# EAGLE design TF0060DCA (EAGLE 9.6.2)
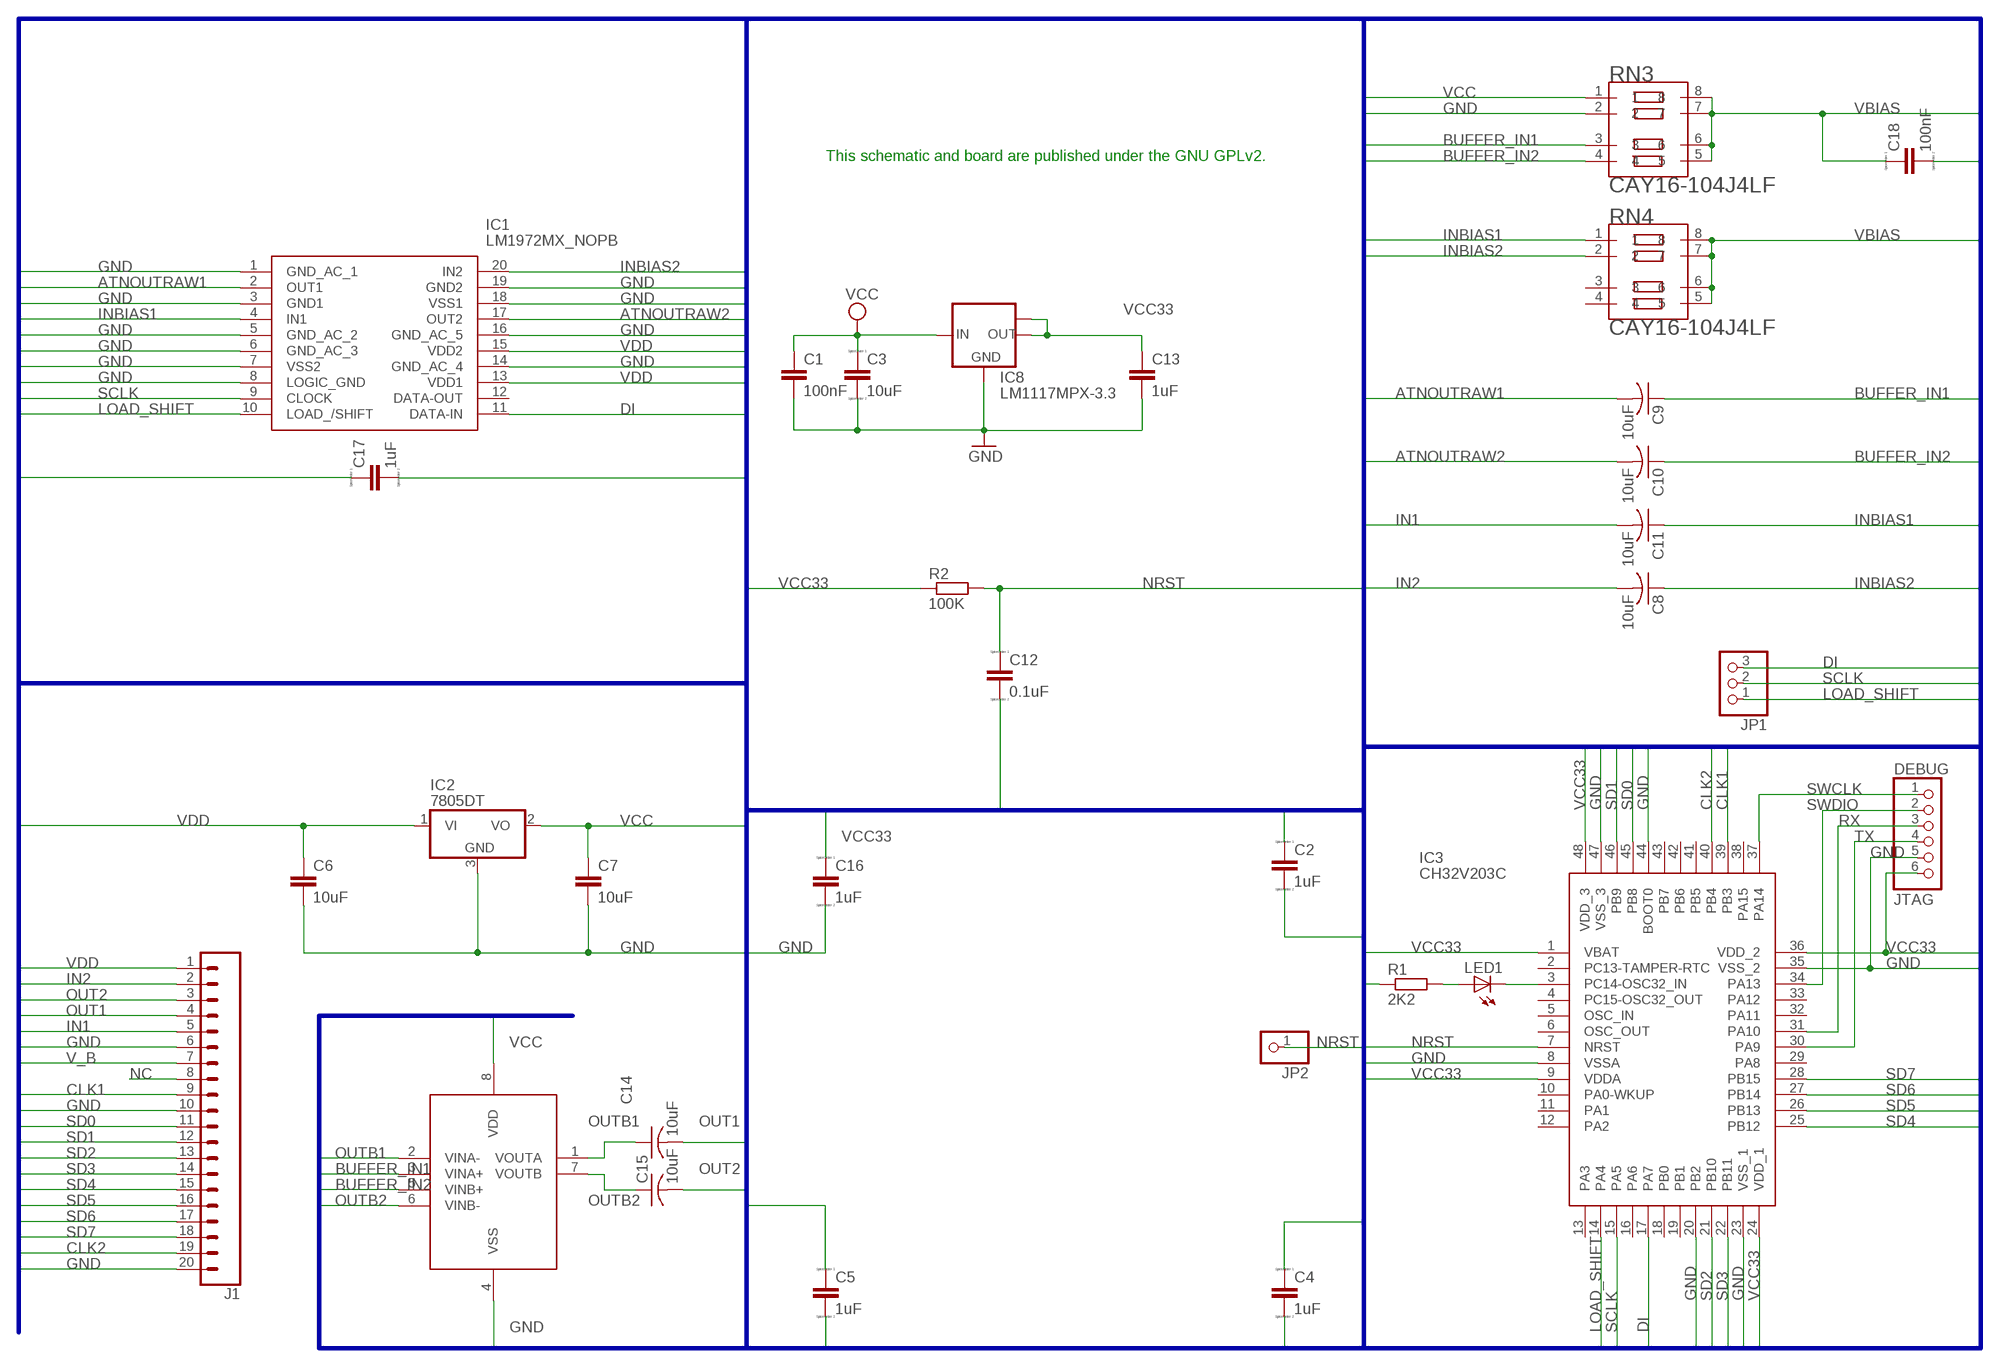
[diagram p0: schematic, sheet 1]

## Parts
C1  100nF  C-EUC1206  [C1206]
C2  1uF  CC0603  [C0603]
C3  10uF  CC0603  [C0603]
C4  1uF  CC0603  [C0603]
C5  1uF  CC0603  [C0603]
C6  10uF  C-EUC1206  [C1206]
C7  10uF  C-EUC1206  [C1206]
C8  10uF  C-USC0805  [C0805]
C9  10uF  C-USC0805  [C0805]
C10  10uF  C-USC0805  [C0805]
C11  10uF  C-USC0805  [C0805]
C12  0.1uF  CC0603  [C0603]
C13  1uF  C-EUC1206  [C1206]
C14  10uF  C-USC0805  [C0805]
C15  10uF  C-USC0805  [C0805]
C16  1uF  CC0603  [C0603]
C17  1uF  CC0603  [C0603]
C18  100nF  CC0603  [C0603]
DEBUG  JTAG  HEADER-1X6ROUND  [1X06_ROUND]
IC1  LM1972MX_NOPB  [SOIC127P1030X265-20N]
IC2  7805DT  [TO252]
IC3  CH32V203C  STM32F103CBT6  [QFP50P900X900X160-48N]
IC8  LM1117MPX-3.3  [SOT223]
IC12  MCP6002T-I_SN  [SOIC127P600X175-8N]
J1  CONN_20  [1X20]
JP1  PINHD-1X3  [1X03]
JP2  PINHD-1X1  [1X01]
LED1  LEDCHIPLED_0603  [CHIPLED_0603]
R1  2K2  R-EU_R0603  [R0603]
R2  100K  R-EU_R0603  [R0603]
RN3  CAY16-104J4LF  CAY16-103J4LF  [RESCAXE80P320X160-8N]
RN4  CAY16-104J4LF  CAY16-103J4LF  [RESCAXE80P320X160-8N]

## Nets
ATNOUTRAW1: C9.2 IC1.2(OUT1)
ATNOUTRAW2: C10.2 IC1.17(OUT2)
BUFFER_IN1: C9.1 IC12.3(VINA+) RN3.3
BUFFER_IN2: C10.1 IC12.5(VINB+) RN3.4
CLK1: IC3.39(PB3) J1.9
CLK2: IC3.40(PB4) J1.19
DI: IC1.11(DATA-IN) IC3.17(PA7) JP1.3
GND: C1.2 C2.2 C3.2 C4.2 C5.2 C6.2 C7.2 C12.2 C13.2 C16.2 C17.2 C18.2 DEBUG.5 IC1.1(GND_AC_1) IC1.3(GND1) IC1.5(GND_AC_2) IC1.6(GND_AC_3) IC1.7(VSS2) IC1.8(LOGIC_GND) IC1.14(GND_AC_4) IC1.16(GND_AC_5) IC1.18(VSS1) IC1.19(GND2) IC2.3(GND) IC3.8(VSSA) IC3.20(PB2) IC3.23(VSS_1) IC3.35(VSS_2) IC3.44(BOOT0) IC3.47(VSS_3) IC8.1(GND) IC12.4(VSS) J1.6 J1.10 J1.20 RN3.2
IN1: C11.2 J1.5
IN2: C8.2 J1.2
INBIAS1: C11.1 IC1.4(IN1) RN4.1
INBIAS2: C8.1 IC1.20(IN2) RN4.2
LOAD_SHIFT: IC1.10(LOAD_/SHIFT) IC3.14(PA4) JP1.1
N$3: IC3.3(PC14-OSC32_IN) LED1.C
N$4: LED1.A R1.2
NC: J1.8
NRST: C12.1 IC3.7(NRST) JP2.1 R2.2
OUT1: C14.2 J1.4
OUT2: C15.2 J1.3
OUTB1: C14.1 IC12.1(VOUTA) IC12.2(VINA-)
OUTB2: C15.1 IC12.6(VINB-) IC12.7(VOUTB)
RX: DEBUG.3 IC3.31(PA10)
SCLK: IC1.9(CLOCK) IC3.15(PA5) JP1.2
SD0: IC3.45(PB8) J1.11
SD1: IC3.46(PB9) J1.12
SD2: IC3.21(PB10) J1.13
SD3: IC3.22(PB11) J1.14
SD4: IC3.25(PB12) J1.15
SD5: IC3.26(PB13) J1.16
SD6: IC3.27(PB14) J1.17
SD7: IC3.28(PB15) J1.18
SWCLK: DEBUG.1 IC3.37(PA14)
SWDIO: DEBUG.2 IC3.34(PA13)
TX: DEBUG.4 IC3.30(PA9)
V_B: J1.7
VBIAS: C18.1 RN3.5 RN3.6 RN3.7 RN3.8 RN4.5 RN4.6 RN4.7 RN4.8
VCC: C1.1 C3.1 C7.1 C17.1 IC2.2(VO) IC8.3(IN) IC12.8(VDD) RN3.1
VCC33: C2.1 C4.1 C5.1 C13.1 C16.1 DEBUG.6 IC3.1(VBAT) IC3.9(VDDA) IC3.24(VDD_1) IC3.36(VDD_2) IC3.48(VDD_3) IC8.2(OUT) IC8.TAB(OUT1) R1.1 R2.1
VDD: C6.1 IC1.13(VDD1) IC1.15(VDD2) IC2.1(VI) J1.1
Unconnected: IC1.12(DATA-OUT) IC3.2(PC13-TAMPER-RTC) IC3.4(PC15-OSC32_OUT) IC3.5(OSC_IN) IC3.6(OSC_OUT) IC3.10(PA0-WKUP) IC3.11(PA1) IC3.12(PA2) IC3.13(PA3) IC3.16(PA6) IC3.18(PB0) IC3.19(PB1) IC3.29(PA8) IC3.32(PA11) IC3.33(PA12) IC3.38(PA15) IC3.41(PB5) IC3.42(PB6) IC3.43(PB7) RN4.3 RN4.4

## Buses
ATNOUTRAW[1..2],BUFFER_IN[1..2],CLK[1..2],CLKOUT,DI,DO,GND,IN[1..2],INBIAS[1..2],LOAD_SHIFT,NRST,OBUF[1..2],OUT[1..2],OUTB[1..2],SCLK,SD[0..7],TCK,TDI,TDO,TMS,V_B,VBIAS,VCC,VCC33,VDD

## Notes on the sheet
- This schematic and board are published under the GNU GPLv2.

## Library data of the parts
C1 C6 C7 C13 = rcl:C-EU: CAPACITOR, European symbol; SPICEPREFIX: C
C2-C5 C12 C16-C18 = eagle-ltspice:C: CAPACITOR, European symbol; SPICEMODEL: NONE; SPICEPREFIX: C
C8-C11 C14 C15 = rcl:C-US: CAPACITOR, American symbol; SPICEPREFIX: C
DEBUG = microbuilder:HEADER-1X6: PIN HEADER
IC1 = SamacSys_Parts:LM1972MX_NOPB: Micro-Pot 2-Channel 78 dB Audio Attenuator with Mute Source: Datasheet <http://www.ti.com/lit/gpn/LM1972>; DESCRIPTION: Micro-Pot 2-Channel 78 dB Audio Attenuator with Mute; HEIGHT: 2.65mm; MANUFACTURER_NAME: Texas Instruments; MANUFACTURER_PART_NUMBER: LM1972MX/NOPB; MOUSER_PART_NUMBER: 926-LM1972MX/NOPB; MOUSER_PRICE-STOCK: https://www.mouser.co.uk/ProductDetail/Texas-Instruments/LM1972MX-NOPB?qs=X1J7HmVL2ZH04ksznhxyxw%3D%3D
IC2 = linear:78*: Positive VOLTAGE REGULATOR Source: http://cache.national.com/ds/LM/LM78L05.pdf http://www.fairchildsemi.com/ds/LM/LM7805.pdf
IC3 = SamacSys_Parts:STM32F103CBT6: STM32F103CBT6, 32 bit ARM Cortex M3 , 72MHz, 128 kB ROM , 20 kB RAM USB CAN I2C, 48 LQFP Source: Datasheet <http://www.st.com/st-web-ui/static/active/en/resource/technical/document/datasheet/CD00161566.pdf>; DESCRIPTION: STM32F103CBT6, 32 bit ARM Cortex M3 , 72MHz, 128 kB ROM , 20 kB RAM USB CAN I2C, 48 LQFP; HEIGHT: 1.6mm; MANUFACTURER_NAME: STMicroelectronics; MANUFACTURER_PART_NUMBER: STM32F103CBT6; MOUSER_PART_NUMBER: 511-STM32F103CBT6; MOUSER_PRICE-STOCK: https://www.mouser.co.uk/ProductDetail/STMicroelectronics/STM32F103CBT6?qs=WxFF5lh7QM3goh6GV5Ogig%3D%3D
IC8 = lm1117:LM1117MPX-*
IC12 = MCP6002T-I_SN:MCP6002T-I_SN: Op. Amplifier Dual 1MHz Low-Power SOIC8 Microchip MCP6002T-I/SN, Dual Low Power Op Amp, 1MHz Rail-Rail, 1.8 6 V, 8-Pin SOIC Source: Datasheet <http://uk.rs-online.com/web/p/products/8234276P>; ALLIED_NUMBER: 70451327; DESCRIPTION: Op. Amplifier Dual 1MHz Low-Power SOIC8 Microchip MCP6002T-I/SN, Dual Low Power Op Amp, 1MHz Rail-Rail, 1.8 6 V, 8-Pin SOIC; HEIGHT: 1.75mm; MANUFACTURER_NAME: Microchip; MANUFACTURER_PART_NUMBER: MCP6002T-I/SN; RS_PART_NUMBER: 8234276P; RS_PRICE-STOCK: http://uk.rs-online.com/web/p/products/8234276P
J1 = SparkFun-Connectors:CONN_20: Multi connection point. Often used as Generic Header-pin footprint for 0.1 inch spaced/style header connections On any of the 0.1 inch spaced packages, you can populate with these: Break Away Headers - Straight <https://www.sparkfun.com/products/116> (PRT-00116) Break Away Male Headers - Right Angle <https://www.sparkfun.com/products/553> (PRT-00553) Female Headers <https://www.sparkfun.com/products/115> (PRT-00115) Break Away Headers - Machine Pin <https://www.sparkfun.com/products/117> (PRT-00117) Break Away Female Headers - Swiss Machine Pin <https://www.sparkfun.com/products/743> (PRT-00743) For SCREWTERMINALS and SPRING TERMINALS visit here: Screw Terimnals on SparkFun.com <https://www.sparkfun.com/search/results?term=Screw+Terminals> (5mm/3.5mm/2.54mm spacing) This device is also useful as a general connection point to wire up your design to another part of your project. Our various solder wires solder well into these plated through hole pads. Hook-Up Wire - Assortment (Stranded, 22 AWG) <https://www.sparkfun.com/products/11375> (PRT-11375) Hook-Up Wire - Assortment (Solid Core, 22 AWG) <https://www.sparkfun.com/products/11367> (PRT-11367) View the entire wire category on our website here <https://www.sparkfun.com/categories/141> Special notes: Molex polarized connector foot print use with SKU : PRT-08231 with associated crimp pins and housings. 1MM SMD Version SKU: PRT-10208 NOTES ON THE VARIANTS LOCK and LOCK_LONGPADS... This footprint was designed to help hold the alignment of a through-hole component (i.e. 6-pin header) while soldering it into place. You may notice that each hole has been shifted either up or down by 0.005 of an inch from it's more standard position (which is a perfectly straight line). This slight alteration caused the pins (the squares in the middle) to touch the edges of the holes. Because they are alternating, it causes a "brace" to hold the component in place. 0.005 has proven to be the perfect amount of "off-center" position when using our standard breakaway headers. Although looks a little odd when you look at the bare footprint, once you have a header in there, the alteration is very hard to notice. Also,if you push a header all the way into place, it is covered up entirely on the bottom side. Note about LOCK SPECIAL package: This is just like the LOCK variant in that the holes are staggared by 5 mil, but except for the last two holes. They are not altered from the "standard" footprint layout. This is used for a special purpose on the layout of our Graphic LCD Backpack. Make sure you want to use this device before selecting it for you project!
JP1 = adafruit:PINHD-1X3: PIN HEADER
JP2 = pinhead:PINHD-1X1: PIN HEADER
LED1 = adafruit:LED: LED OSRAM: - CHIPLED LG R971, LG N971, LY N971, LG Q971, LY Q971, LO R971, LY R971 LH N974, LH R974 LS Q976, LO Q976, LY Q976 LO Q996 - Hyper CHIPLED LW Q18S LB Q993, LB Q99A, LB R99A - SideLED LS A670, LO A670, LY A670, LG A670, LP A670 LB A673, LV A673, LT A673, LW A673 LH A674 LY A675 LS A676, LA A676, LO A676, LY A676, LW A676 LS A679, LY A679, LG A679 - Hyper Micro SIDELED® LS Y876, LA Y876, LO Y876, LY Y876 LT Y87S - SmartLED LW L88C, LW L88S LB L89C, LB L89S, LG L890 LS L89K, LO L89K, LY L89K LS L896, LA L896, LO L896, LY L896 - TOPLED LS T670, LO T670, LY T670, LG T670, LP T670 LSG T670, LSP T670, LSY T670, LOP T670, LYG T670 LG T671, LOG T671, LSG T671 LB T673, LV T673, LT T673, LW T673 LH T674 LS T676, LA T676, LO T676, LY T676, LB T676, LH T676, LSB T676, LW T676 LB T67C, LV T67C, LT T67C, LS T67K, LO T67K, LY T67K, LW E67C LS E67B, LA E67B, LO E67B, LY E67B, LB E67C, LV E67C, LT E67C LW T67C LS T679, LY T679, LG T679 LS T770, LO T770, LY T770, LG T770, LP T770 LB T773, LV T773, LT T773, LW T773 LH T774 LS E675, LA E675, LY E675, LS T675 LS T776, LA T776, LO T776, LY T776, LB T776 LHGB T686 LT T68C, LB T68C - Hyper Mini TOPLED® LB M676 - Mini TOPLED Santana® LG M470 LS M47K, LO M47K, LY M47K Source: http://www.osram.convergy.de/
R1 R2 = resistor:R-EU_: RESISTOR, European symbol
RN3 RN4 = CAY16-103J4LF:CAY16-103J4LF: Res Thick Film Array 10K Ohm 5% 200ppm/C ISOL Molded 8-Pin 1206(4 X 0603) Convex SMD Paper T/R; AVAILABILITY: Good; DESCRIPTION: Res Thick Film Array 10K Ohm 5% ?200ppm/C ISOL Molded 8-Pin 1206(4 X 0603) Convex SMD Paper T/R; MF: Bourns; MP: CAY16-103J4LF; PACKAGE: 1206 Bourns; PRICE: 0.02 USD

## Net classes
0 default: width 0.152 mm, drill 0.3 mm, clearance 0.152 mm

## Board
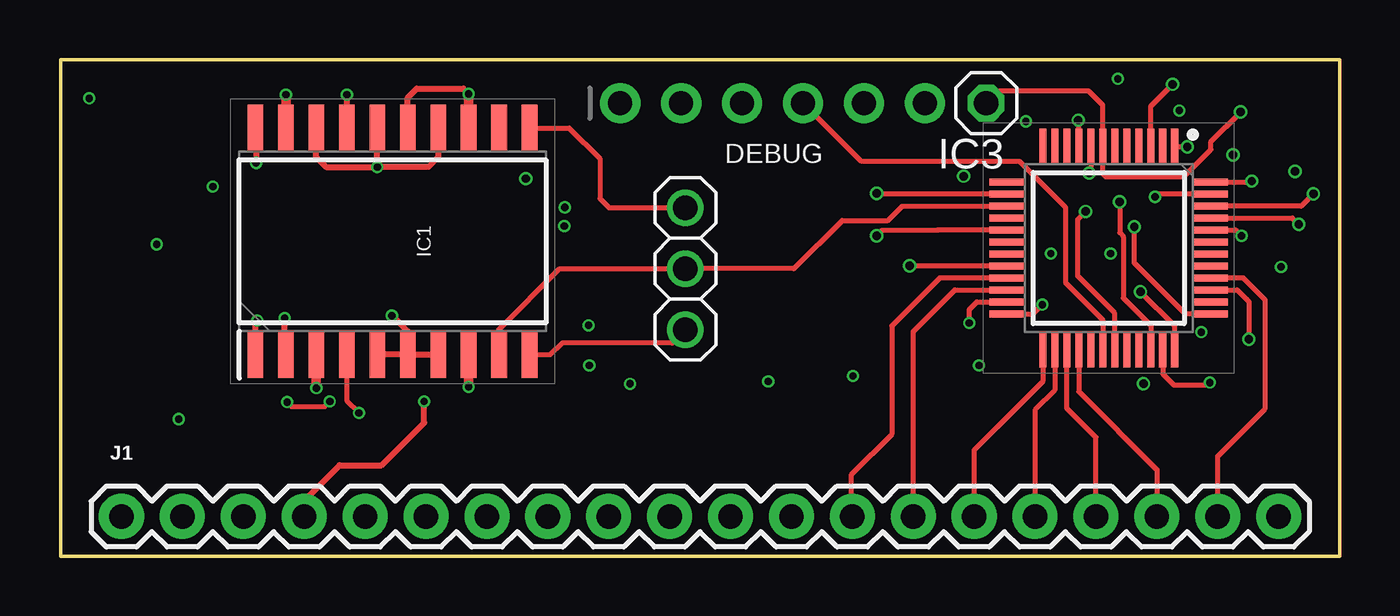
[diagram p1: board, top side]
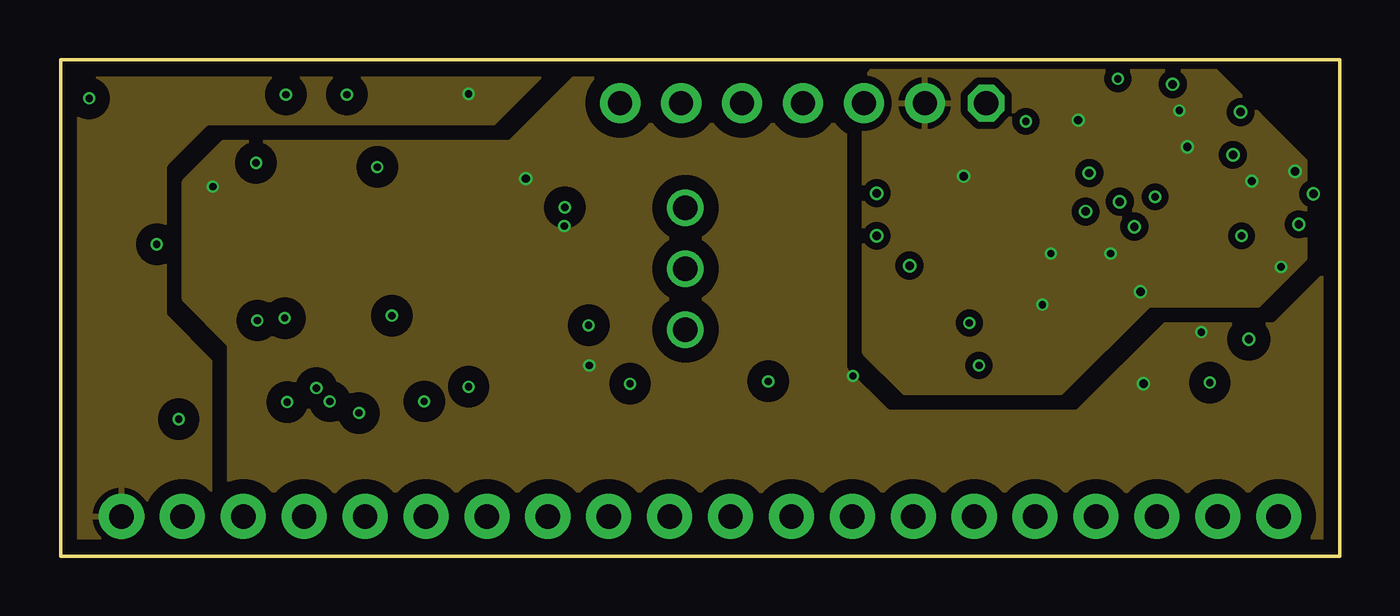
[diagram p2: board, inner layer PWR]
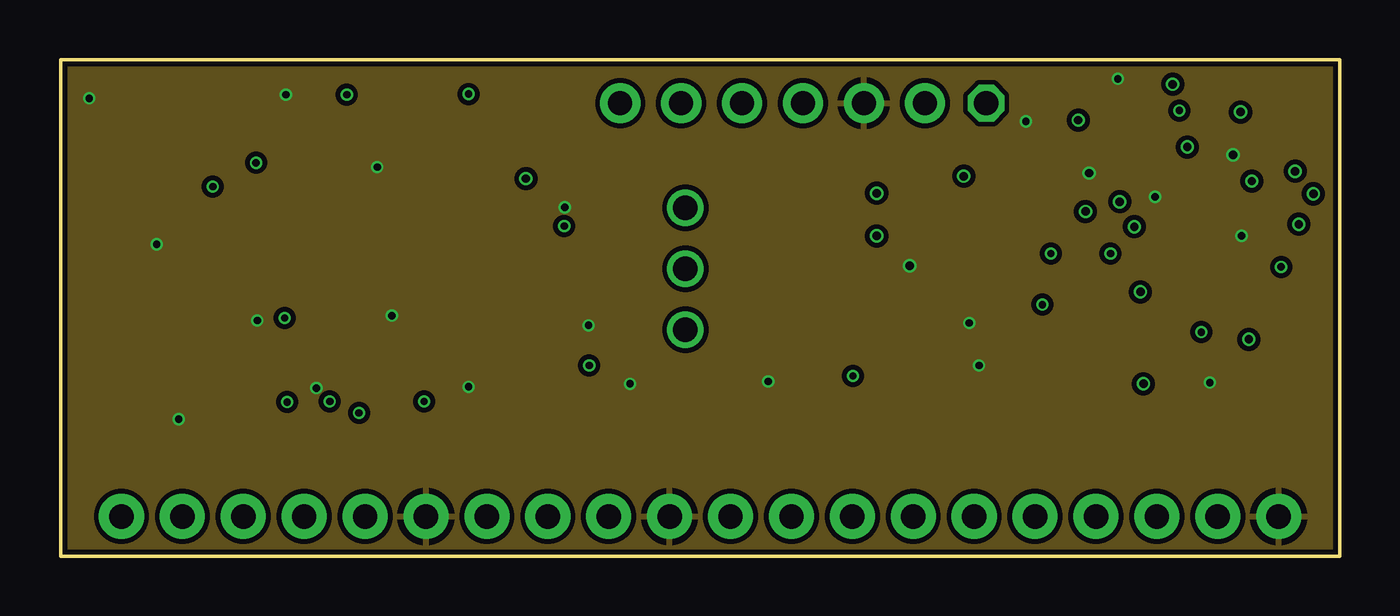
[diagram p3: board, inner layer GND]
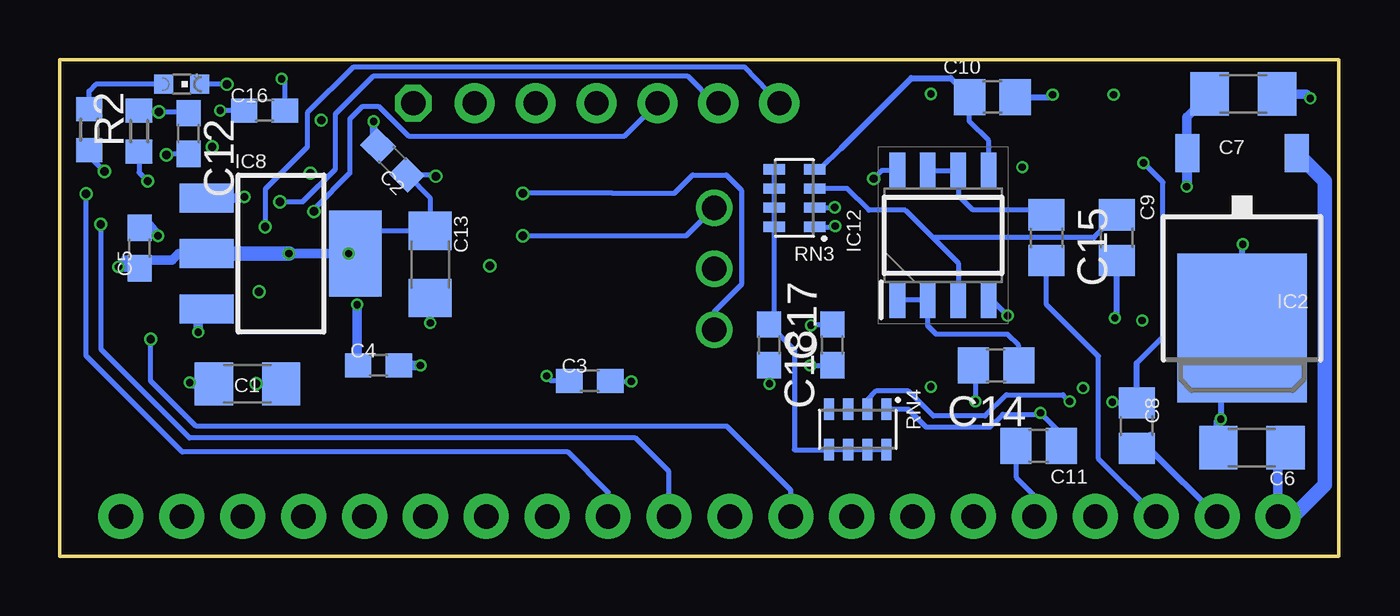
[diagram p4: board, bottom side, seen from below]

Size 53.34 x 20.7 mm. Coordinates in mm from the lower left corner, seen from the top.
Outline: 0,0 0,20.7 53.34,20.7 53.34,0 0,0
Copper layers (1*2*15*16): Top 0.035559375mm / dielectric 0.17018125mm / PWR 0.01778125mm / dielectric 47mil / GND 0.01778125mm / dielectric 0.17018125mm / Bottom 0.035559375mm
Design rules "jlcpcb-4-layer (1) *": minimum track width 6mil, minimum drill 0.2mm, track to track 7mil, track to pad 7mil, pad to pad 7mil, via to via 7mil, smd to smd 0mil, copper to edge 0.1mm, drill to drill 5mil, minimum pad ring 4mil, minimum via ring 4mil, stop-mask expansion 3mil, vias tented up to drill 100mil, thermal gap 10mil

### Footprints (pad centres in the part's own frame; a part is rotated, then mirrored left to right if it is on the bottom)
C1206 = smd 1.6 x 1.8: 1 -1.4,0; 2 1.4,0
C0603 = smd 1.1 x 1: 1 -0.85,0; 2 0.85,0
C0805 = smd 1.3 x 1.5: 1 -0.95,0; 2 0.95,0
1X06_ROUND = drill 1 pad 1.676: 1 -6.35,0; 2 -3.81,0; 3 -1.27,0; 4 1.27,0; 5 3.81,0; 6 6.35,0
SOIC127P1030X265-20N = smd 1.95 x 0.65: 1 -4.725,5.715; 2 -4.725,4.445; 3 -4.725,3.175; 4 -4.725,1.905; 5 -4.725,0.635; 6 -4.725,-0.635; 7 -4.725,-1.905; 8 -4.725,-3.175; 9 -4.725,-4.445; 10 -4.725,-5.715; 11 4.725,-5.715; 12 4.725,-4.445; 13 4.725,-3.175; 14 4.725,-1.905; 15 4.725,-0.635; 16 4.725,0.635; 17 4.725,1.905; 18 4.725,3.175; 19 4.725,4.445; 20 4.725,5.715
TO252 = smd 1 x 1.6: 1 -2.28,-4.8; 2 2.28,-4.8 | smd 5.4 x 6.2: 3 0,2.5
QFP50P900X900X160-48N = smd 1.475 x 0.3: 1 -4.238,2.75; 2 -4.238,2.25; 3 -4.238,1.75; 4 -4.238,1.25; 5 -4.238,0.75; 6 -4.238,0.25; 7 -4.238,-0.25; 8 -4.238,-0.75; 9 -4.238,-1.25; 10 -4.238,-1.75; 11 -4.238,-2.25; 12 -4.238,-2.75; 25 4.238,-2.75; 26 4.238,-2.25; 27 4.238,-1.75; 28 4.238,-1.25; 29 4.238,-0.75; 30 4.238,-0.25; 31 4.238,0.25; 32 4.238,0.75; 33 4.238,1.25; 34 4.238,1.75; 35 4.238,2.25; 36 4.238,2.75 | smd 0.3 x 1.475: 13 -2.75,-4.238; 14 -2.25,-4.238; 15 -1.75,-4.238; 16 -1.25,-4.238; 17 -0.75,-4.238; 18 -0.25,-4.238; 19 0.25,-4.238; 20 0.75,-4.238; 21 1.25,-4.238; 22 1.75,-4.238; 23 2.25,-4.238; 24 2.75,-4.238; 37 2.75,4.238; 38 2.25,4.238; 39 1.75,4.238; 40 1.25,4.238; 41 0.75,4.238; 42 0.25,4.238; 43 -0.25,4.238; 44 -0.75,4.238; 45 -1.25,4.238; 46 -1.75,4.238; 47 -2.25,4.238; 48 -2.75,4.238
SOT223 = smd 1.219 x 2.235: 1 -2.311,-3.099; 2 0,-3.099; 3 2.311,-3.099 | smd 3.6 x 2.2: TAB 0,3.099
SOIC127P600X175-8N = smd 1.5 x 0.65: 1 -2.7,1.905; 2 -2.7,0.635; 3 -2.7,-0.635; 4 -2.7,-1.905; 5 2.7,-1.905; 6 2.7,-0.635; 7 2.7,0.635; 8 2.7,1.905
1X20 = drill 1.016 pad 1.88: 1 0,0; 2 2.54,0; 3 5.08,0; 4 7.62,0; 5 10.16,0; 6 12.7,0; 7 15.24,0; 8 17.78,0; 9 20.32,0; 10 22.86,0; 11 25.4,0; 12 27.94,0; 13 30.48,0; 14 33.02,0; 15 35.56,0; 16 38.1,0; 17 40.64,0; 18 43.18,0; 19 45.72,0; 20 48.26,0
1X03 = drill 1.016: 1 -2.54,0; 2 0,0; 3 2.54,0
1X01 = drill 1.016 octagon: 1 0,0
CHIPLED_0603 = smd 0.8 x 0.8: A 0,-0.75; C 0,0.75
R0603 = smd 1 x 1.1: 1 -0.85,0; 2 0.85,0
RESCAXE80P320X160-8N = smd 0.9 x 0.425: 1 -0.85,1.2; 2 -0.85,0.4; 3 -0.85,-0.4; 4 -0.85,-1.2; 5 0.85,-1.2; 6 0.85,-0.4; 7 0.85,0.4; 8 0.85,1.2

### Placement (x,y rotation side)
C1  45.52,7.19 180 bottom
C2  39.47,16.51 135 bottom
C3  31.24,7.32 0 bottom
C4  40.06,7.95 0 bottom
C5  50.01,12.85 90 bottom
C6  3.63,4.52 180 bottom
C7  3.99,19.28 0 bottom
C8  8.43,5.44 270 bottom
C9  9.27,13.28 270 bottom
C10  14.45,19.15 0 bottom
C11  12.52,4.6 180 bottom
C12  47.98,17.63 270 bottom
C13  37.9,12.17 270 bottom
C14  14.3,7.95 180 bottom
C15  12.19,13.28 270 bottom
C16  44.81,18.59 0 bottom
C17  21.13,8.81 90 bottom
C18  23.77,8.81 270 bottom
DEBUG  29.69,18.9 0 top
IC1  13.84,13.13 90 top
IC2  4.04,12.01 180 bottom
IC3  43.71,12.85 270 top
IC8  44.12,12.62 270 bottom
IC12  16.51,13.39 90 bottom
J1  2.54,1.65 0 top
JP1  26.06,11.99 90 top
JP2  38.61,18.9 0 top
LED1  48.26,19.69 270 bottom
R1  52.12,17.79 90 bottom
R2  50.04,17.73 90 bottom
RN3  22.71,14.94 180 bottom
RN4  20.07,5.28 270 bottom

### Tracks (layer width: path | path; a pad name or v marks a point on that pad's centre or on a via)
ATNOUTRAW1  (via drill 0.3)
  Top 0.254: IC1.2 9.35,8.46 v9.35,9.93
  Bottom 0.254: v9.35,9.93 9.27,10.01 C9.2
ATNOUTRAW2  (via drill 0.3)
  Top 0.254: v11.94,19.25 IC1.17
  Bottom 0.254: C10.2 12.04,19.15 v11.94,19.25
BUFFER_IN1
  Bottom 0.203: IC12.3 15.88,12.22 16.94,13.28 | 16.94,13.28 18.09,14.43 19.61,14.43 20.52,15.34 RN3.3 | C9.1 10.22,13.28 16.94,13.28
BUFFER_IN2
  Bottom 0.203: IC12.5 14.61,17.32 15.4,18.12 C10.1 | 20.76,17.01 21.64,16.14 RN3.4
  Bottom 0.254: 20.76,17.01 17.83,19.94 16.19,19.94 C10.1
CLK1  (via drill 0.35)
  Top 0.203: IC3.39 49.07,11.1 49.55,10.62 v49.55,9.05
  Bottom 0.203: J1.9 22.86,2.74 25.53,5.41 47.65,5.41 49.55,7.32 v49.55,9.05
CLK2
  Top 0.203: IC3.40 49.33,11.6 50.24,10.69 50.24,6.15 48.26,4.17 J1.19
DI  (via drill 0.35)
  Top 0.203: JP1.3 | JP1.3 22.89,14.53 22.49,14.92 22.49,16.57 21.21,17.86 IC1.11 | v34.04,13.36 34.27,13.59 36.57,13.59 36.59,13.6 IC3.17
  Bottom 0.203: JP1.3 27.23,13.36 v34.04,13.36
GND  (via drill 0.3, 0.35)
  Top 0.203: 13.31,16.33 v13.21,16.23 | IC3.8 42.96,16.04 v42.9,15.98 | IC3.47 45.76,15.1 v45.64,14.99 | IC3.44 49.01,13.6 v49.25,13.36 | v37.9,9.73 37.9,10.29 38.21,10.6 IC3.23 | IC3.20 v35.42,12.1 v35.41,12.12 | v47.93,7.24 47.83,7.14 46.43,7.14 45.96,7.6 IC3.35
  Top 0.254: IC1.6 IC1.7 | IC1.6 IC1.5 | IC1.6 14.48,9.37 v13.82,10.03 | IC1.1 8.13,9.75 v8.2,9.83 | IC1.14 15.75,16.64 15.34,16.23 13.41,16.23 | IC1.16 13.21,16.43 13.31,16.33 13.41,16.23 | 13.41,16.23 v13.21,16.23 11.07,16.23 10.67,16.64 IC1.18
  Top 0.406: IC1.19 v9.4,19.25 | IC1.8 v17.02,7.06 | IC1.3 v10.67,7.01
  Bottom 0.203: C3.2 30.37,7.29 v29.52,7.29 | C16.2 43.96,19.78 v44.09,19.91 | RN3.2 21.05,14.54 v21.03,14.55 | IC12.4 14.47,10.69 v13.82,10.03 | C18.2 23.77,7.21 v23.75,7.19 | v22.02,9.63 21.98,9.66 C17.2 | C12.2 48.86,16.78 v48.9,16.74
  Bottom 0.254: v4.93,5.71 4.93,8.62 IC2.3 4.04,12.98 v4.01,13.01
  Bottom 0.305: C2.2 40.26,17.3 v40.26,18.14 | C13.2 v37.9,9.73
  Bottom 0.406: v47.93,7.24 47.88,7.19 C1.2 | C5.2 49.62,13.81 v49.25,13.36 | C4.2 v38.3,7.95 | IC8.1 45.7,14.94 v45.64,14.99 | C7.2 1.37,19.28 v1.19,19.1 | v4.93,5.71 5.03,5.61 C6.2
  pour GND (isolate 0.203, rank 2): 0,20.7 0,0 53.34,0 53.34,20.7
IN1
  Bottom 0.203: J1.5 12.7,2.51 13.47,3.28 C11.2
IN2
  Bottom 0.254: C8.2 7.86,5.06 7.86,4.43 J1.2
INBIAS1  (via drill 0.3)
  Top 0.203: IC1.4 11.94,6.48 v12.45,5.97
  Bottom 0.203: C11.1 11.57,5.09 v12.45,5.97 12.5,5.92 14.02,5.92 14.55,5.38 17.22,5.38 17.97,6.13 RN4.1
INBIAS2  (via drill 0.3)
  Top 0.203: v9.45,6.43 9.65,6.22 11,6.22 v11.23,6.45
  Top 0.254: IC1.20 8.15,17.83 v8.15,16.41
  Bottom 0.203: 8.43,8.05 7.34,9.14 7.34,15.6 v8.15,16.41 | RN4.2 19.67,6.52 19.28,6.91 17.98,6.91 16.92,5.84 14.76,5.84 13.87,6.73 11.51,6.73 v11.23,6.45 | v9.45,6.43 9.41,6.39 C8.1
  Bottom 0.254: C8.1 8.43,8.05
LOAD_SHIFT  (via drill 0.35)
  Top 0.203: IC1.10 20.42,8.41 20.9,8.89 25.5,8.89 JP1.1 | IC3.14 34.07,15.1 v34.04,15.14
  Bottom 0.203: v34.04,15.14 30.3,15.14 27.71,15.14 26.95,15.9 25.55,15.9 24.92,15.27 24.92,11.33 26.06,10.19 JP1.1
N$3  (via drill 0.35)
  Top 0.203: IC3.3 45.46,18.77 v46.38,19.69
  Bottom 0.203: v46.38,19.69 LED1.C
N$4
  Bottom 0.203: R1.2 52.12,19.41 51.84,19.69 LED1.A
NRST  (via drill 0.35)
  Top 0.203: v49.21,18.53 47.98,17.3 47.98,16.97 46.84,15.82 43.59,15.82 43.46,15.95 IC3.7 43.46,18.82 42.88,19.41 39.12,19.41 JP2.1
  Bottom 0.203: R2.2 49.26,18.58 v49.21,18.53 48.03,18.53 C12.1
OUT1  (via drill 0.3)
  Top 0.254: J1.4 10.16,2.31 11.63,3.79 13.39,3.79 15.16,5.56 v15.16,6.45
  Bottom 0.203: C14.2 15.16,7.86 v15.16,6.45
OUT2
  Bottom 0.203: C15.2 12.19,10.49 10.03,8.33 10.03,4.06 J1.3
OUTB1
  Bottom 0.203: IC12.1 IC12.2 17.14,9.6 16.79,9.25 13.82,9.25 13.35,8.78 C14.1
OUTB2
  Bottom 0.203: IC12.7 IC12.6 15.88,15.05 15.29,14.46 12.42,14.46 C15.1
RX  (via drill 0.35)
  Top 0.203: IC3.31 43.96,10.14 42.42,11.68 42.42,14.05 v42.75,14.38
  Bottom 0.203: DEBUG.3 29.82,17.5 38.77,17.5 40.02,18.75 40.74,18.75 41.25,18.24 41.25,15.98 42.75,14.48 v42.75,14.38
SCLK
  Top 0.203: IC1.9 18.29,9.46 20.82,11.99 JP1.2 30.58,11.99 32.6,14.01 34.51,14.01 35.1,14.6 IC3.15
SD0  (via drill 0.35)
  Top 0.203: IC3.45 51.38,14.1 v51.64,13.84
  Bottom 0.203: J1.11 27.94,3.53 29.34,4.93 47.93,4.93 51.12,8.12 51.23,8.23 51.64,8.64 v51.64,13.84
SD1  (via drill 0.35)
  Top 0.203: v52.25,15.11 51.74,14.6 IC3.46
  Bottom 0.203: J1.12 30.48,2.67 32.16,4.34 48.23,4.34 52.25,8.36 v52.25,15.11
SD2
  Top 0.203: IC3.21 36.67,11.6 34.67,9.6 34.67,5.08 32.97,3.38 32.97,1.7 J1.13
SD3
  Top 0.203: J1.14 35.56,9.37 37.29,11.1 IC3.22
SD4
  Top 0.203: J1.15 38.1,4.42 40.96,7.28 IC3.25
SD5
  Top 0.203: IC3.26 41.46,6.92 40.64,6.1 J1.16
SD6
  Top 0.203: J1.17 43.18,4.95 41.96,6.17 IC3.27
SD7
  Top 0.203: IC3.28 42.46,6.86 45.72,3.61 J1.18
SWCLK  (via drill 0.35)
  Top 0.203: IC3.37 46.91,10.1 44.78,12.24 v44.78,13.74
  Bottom 0.203: DEBUG.1 24.76,20.4 41.12,20.4 43.03,18.49 43.03,17.07 44.78,15.32 v44.78,13.74
SWDIO  (via drill 0.35)
  Top 0.203: IC3.34 45.46,9.63 44.32,10.77 44.32,13.34 44.17,13.49 v44.17,14.78
  Bottom 0.203: DEBUG.2 26.04,18.9 27.15,20.02 40.28,20.02 41.85,18.45 41.85,16.15 43.22,14.78 v44.17,14.78
TX
  Top 0.203: IC3.30 43.46,9.86 41.91,11.41 41.91,14.55 40.01,16.46 33.4,16.46 DEBUG.4
VBIAS
  Bottom 0.203: RN3.5 RN3.6 RN3.7 RN3.8 23.56,11.99 23.56,9.88 C18.1 22.71,8.6 22.71,4.43 RN4.5 RN4.6 RN4.7 RN4.8
VCC  (via drill 0.3, 0.35)
  Bottom 0.203: C3.1 32.84,7.32 v33.05,7.52 | RN3.1 21.04,13.74 v21.01,13.77 | v22.05,7.95 21.15,7.95 C17.1 | C1.1 v45.16,7.19 | IC12.8 19.07,16.09 v19.41,15.75
  Bottom 0.406: IC8.3 47.57,9.96 v47.57,9.34 | IC2.2 6.32,15.39 v6.34,15.41 | v6.34,15.41 v6.35,15.42 | C7.1 6.34,18.32 v6.34,15.41
  pour PWR (isolate 0.61, rank 2): 7.06,0 7.06,8.81 5.16,10.72 5.16,15.62 6.81,17.27 18.77,17.27 22.12,20.62 53.29,20.62 53.31,20.6 53.31,-0.05 7.06,-0.05
VCC33  (via drill 0.3, 0.35)
  Top 0.203: IC3.24 40.56,10.1 v40.95,10.49 | IC3.9 42.46,18.17 v42.44,18.19 | IC3.1 46.97,17.09 v46.99,17.07 | IC3.48 49.64,15.6 v49.68,15.65 | IC3.36 46.46,9.59 v45.03,11.02
  Bottom 0.203: C16.1 v46.66,18.59 | IC8.TAB 40.08,13.57 C13.1 37.9,14.94 C2.1 37.73,15.91 v37.67,15.85 | R1.1 52.12,16.69 v51.49,16.05 | R2.1 50.04,16 v49.68,15.65
  Bottom 0.406: v43.79,12.62 IC8.TAB | C5.1 50.02,12.07 v50.9,12.07 50.62,12.34 48.67,12.34 48.39,12.62 IC8.2 | C4.1 40.95,7.99 v40.95,10.49
  Bottom 0.61: IC8.2 v43.79,12.62
  other vias: 41.3,12.62
  pour PWR (isolate 0.305): 33.83,20.27 48.11,20.27 51.89,16.48 51.89,12.42 49.94,10.46 45.36,10.46 41.71,6.81 35.2,6.81 33.53,8.48 33.53,19.91 33.86,20.24
VDD  (via drill 0.3)
  Top 0.254: IC1.15 14.48,19.13 14.86,19.51 16.79,19.51 v17.02,19.28
  Top 0.406: IC1.13 v17.02,19.28
  Bottom 0.406: J1.1 2.54,4.21 C6.1
  Bottom 0.61: J1.1 1.91,1.65 0.58,2.97 0.58,15.64 IC2.1
  pour PWR (isolate 0.61, rank 3): 0,20.7 0,0 53.34,-0.13 53.34,20.7